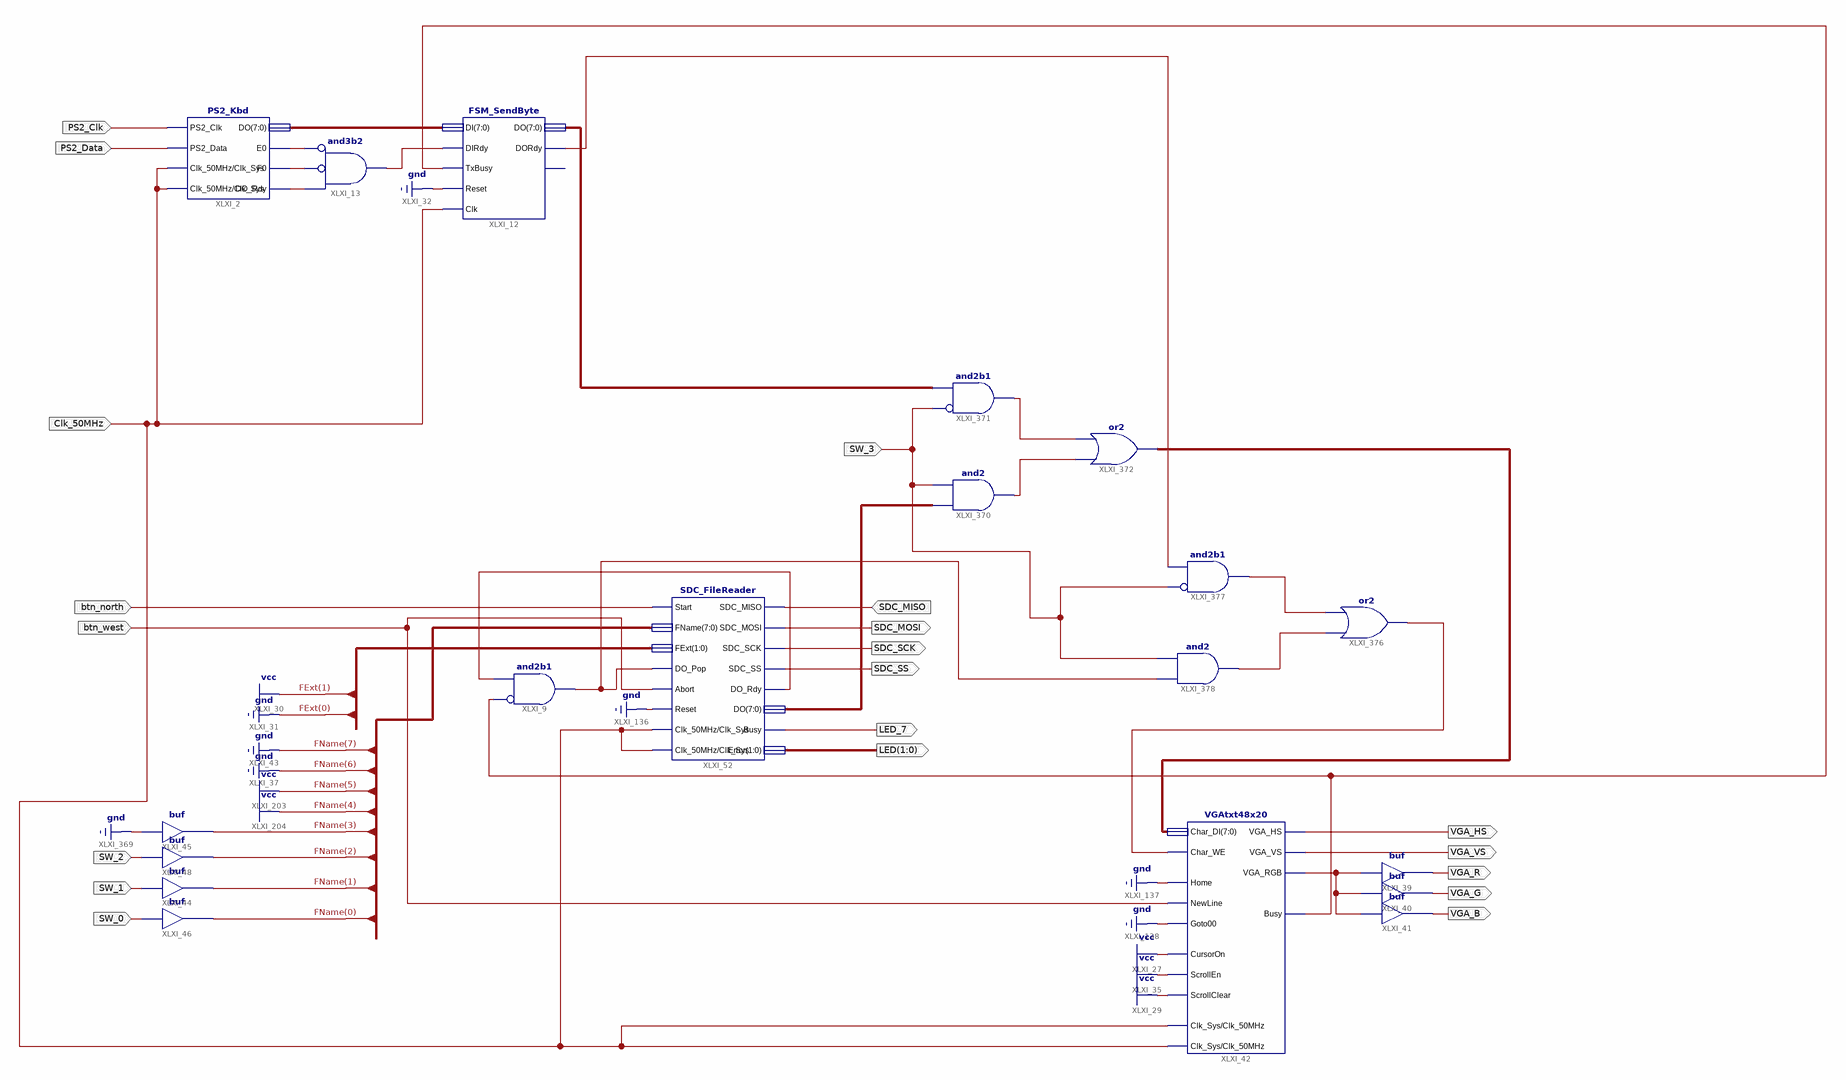
[diagram p0: schematic sheet 1]
// Xilinx ISE schematic tutor.sch (spartan3e) as structural Verilog: 19 symbols, 20 ports
module tutor (
  input  PS2_Clk,
  input  PS2_Data,
  input  SDC_MISO,
  input  btn_north,
  input  btn_west,
  input  SW_0,
  input  SW_1,
  input  SW_2,
  input  SW_3,
  input  Clk_50MHz,
  output SDC_SS,
  output SDC_SCK,
  output LED_7,
  output [1:0] LED,
  output SDC_MOSI,
  output VGA_VS,
  output VGA_HS,
  output VGA_G,
  output VGA_B,
  output VGA_R
);

  wire XLXN_5, XLXN_6, XLXN_7, XLXN_66, XLXN_72, XLXN_564, XLXN_1118, XLXN_1119, XLXN_1129, XLXN_1130,
       XLXN_1172, XLXN_1173, XLXN_1174, XLXN_1177;
  wire [3:0] FName;
  wire [7:0] XLXN_25, XLXN_1124, XLXN_1125, XLXN_1126;

  PS2_Kbd XLXI_2 (
    .PS2_Clk(PS2_Clk), .PS2_Data(PS2_Data), .Clk_50MHz(Clk_50MHz), .E0(XLXN_5), .F0(XLXN_6), .DO_Rdy(XLXN_7),
    .DO(XLXN_25), .Clk_Sys(Clk_50MHz));
  and XLXI_13 (XLXN_72, ~XLXN_5, ~XLXN_6, XLXN_7);  // and3b2
  FSM_SendByte XLXI_12 (
    .DORdy(XLXN_1172), .DO(XLXN_1124), .DI(XLXN_25), .DIRdy(XLXN_72), .TxBusy(XLXN_1177), .Reset(1'b0),
    .Clk(Clk_50MHz));  // open: Busy
  buf XLXI_45 (FName[3], 1'b0);
  buf XLXI_46 (FName[0], SW_0);
  buf XLXI_44 (FName[1], SW_1);
  buf XLXI_48 (FName[2], SW_2);
  and XLXI_9 (XLXN_1173, ~XLXN_1177, XLXN_66);  // and2b1
  SDC_FileReader XLXI_52 (
    .SDC_MISO(SDC_MISO), .Start(btn_north), .FName({4'b0011, FName}), .Reset(1'b0), .Clk_50MHz(Clk_50MHz),
    .DO_Pop(XLXN_1173), .Abort(btn_west), .SDC_MOSI(SDC_MOSI), .SDC_SCK(SDC_SCK), .SDC_SS(SDC_SS),
    .Error(LED), .DO(XLXN_1125), .DO_Rdy(XLXN_66), .Busy(LED_7), .FExt(2'b10), .Clk_Sys(Clk_50MHz));
  assign XLXN_1126 = {8{XLXN_1119}} | {8{XLXN_1118}};  // or2 XLXI_372, 8 bits wide
  assign XLXN_1118 = ~{8{SW_3}} & XLXN_1124;  // and2b1 XLXI_371, 8 bits wide
  assign XLXN_1119 = XLXN_1125 & {8{SW_3}};  // and2 XLXI_370, 8 bits wide
  buf XLXI_39 (VGA_R, XLXN_564);
  buf XLXI_40 (VGA_G, XLXN_564);
  buf XLXI_41 (VGA_B, XLXN_564);
  VGAtxt48x20 XLXI_42 (
    .Char_DI(XLXN_1126), .Home(1'b0), .NewLine(btn_west), .Goto00(1'b0), .Clk_Sys(Clk_50MHz),
    .Clk_50MHz(Clk_50MHz), .CursorOn(1'b1), .ScrollEn(1'b1), .ScrollClear(1'b1), .Busy(XLXN_1177),
    .VGA_HS(VGA_HS), .VGA_VS(VGA_VS), .VGA_RGB(XLXN_564), .Char_WE(XLXN_1174));
  and XLXI_378 (XLXN_1130, XLXN_1173, SW_3);
  and XLXI_377 (XLXN_1129, ~SW_3, XLXN_1172);  // and2b1
  or XLXI_376 (XLXN_1174, XLXN_1130, XLXN_1129);
endmodule
